# EAGLE schematic LoRaWio (EAGLE 6.3)
CNAME: GCLora Wio; COMPANY: Secluded.io; CREVISION: 1; DESIGNER: SkipXtian
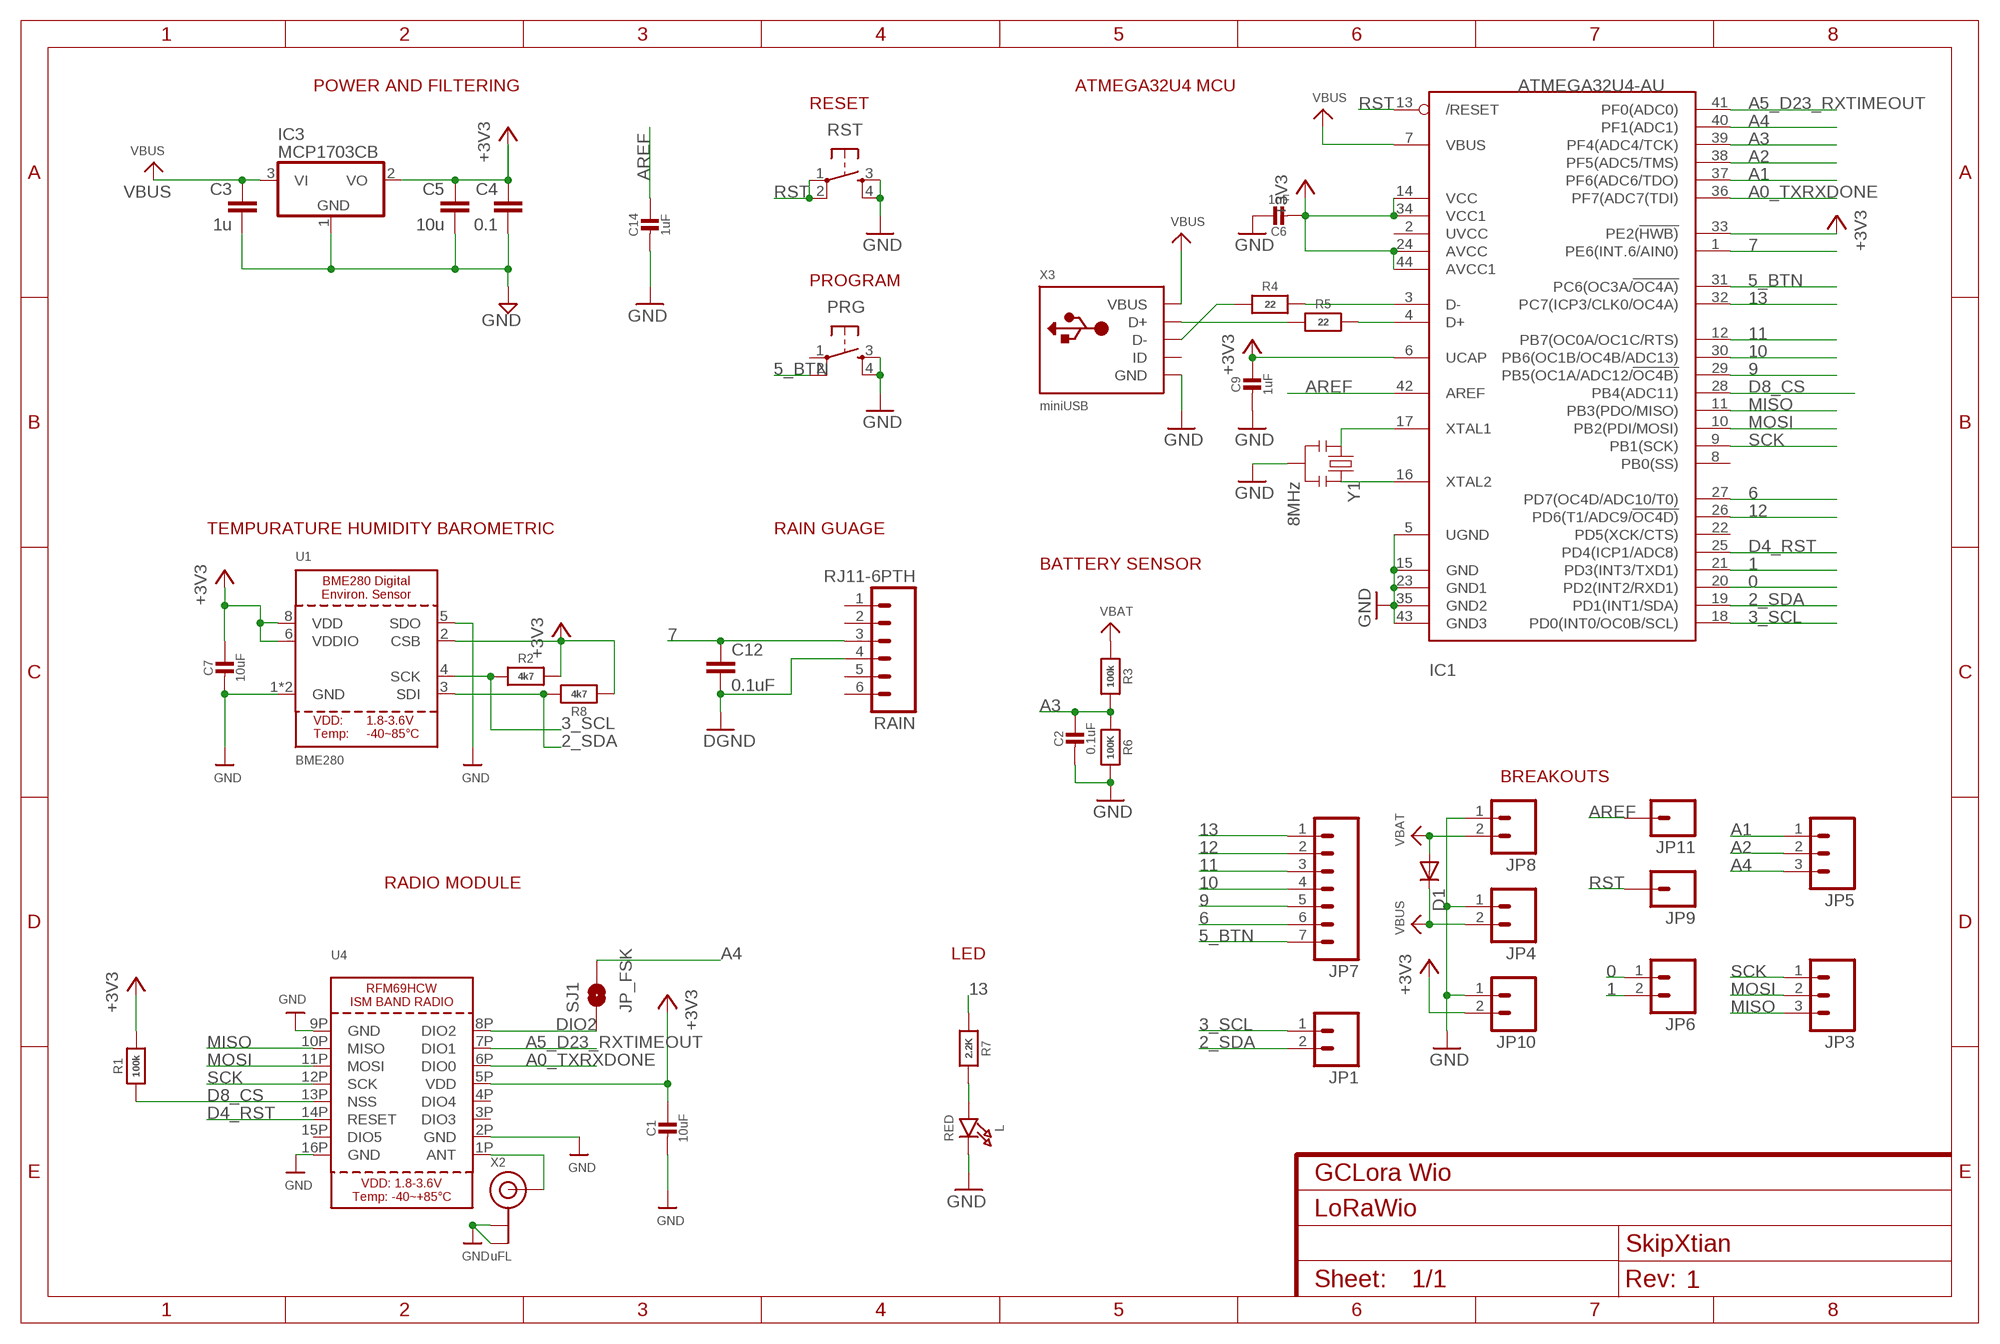
[diagram p0: schematic, sheet 1]

## Parts
C1  10uF  CAP_CERAMIC0805-NOOUTLINE  [0805-NO]
C2  0.1uF  CAP_CERAMIC0805-NOOUTLINE  [0805-NO]
C3  1u  CAP0805  [0805]
C4  0.1  CAP0805  [0805]
C5  10u  CAP0805-CAP  [0805-CAP]
C6  1uF  CAP_CERAMIC0805-NOOUTLINE  [0805-NO]
C7  10uF  CAP_CERAMIC0805-NOOUTLINE  [0805-NO]
C9  1uF  CAP_CERAMIC0805-NOOUTLINE  [0805-NO]
C12  0.1uF  CAP0805  [0805]
C14  1uF  CAP_CERAMIC0805-NOOUTLINE  [0805-NO]
D1  DIODESOD  [SOD-323]
IC1  ATMEGA32U4-AU  [TQFP44]
IC3  MCP1703CB  [SOT23]
JP1  M021X02_NO_SILK  [1X02_NO_SILK]
JP3  M031X03_NO_SILK  [1X03_NO_SILK]
JP4  M021X02_NO_SILK  [1X02_NO_SILK]
JP5  M031X03_NO_SILK  [1X03_NO_SILK]
JP6  M021X02_NO_SILK  [1X02_NO_SILK]
JP7  M07  [1X07]
JP8  M021X02_NO_SILK  [1X02_NO_SILK]
JP9  M01PTH_NO_SILK_YES_STOP  [1X01_NO_SILK]
JP10  M021X02_NO_SILK  [1X02_NO_SILK]
JP11  M01PTH_NO_SILK_YES_STOP  [1X01_NO_SILK]
L  RED  LED0805_NOOUTLINE  [CHIPLED_0805_NOOUTLINE]
PRG  TAC_SWITCHSMD  [TACTILE_SWITCH_SMD]
R1  100k  RESISTOR0805_NOOUTLINE  [0805-NO@1]
R2  4k7  RESISTOR0805_NOOUTLINE  [0805-NO@1]
R3  100k  RESISTOR0805_NOOUTLINE  [0805-NO@1]
R4  22  RESISTOR0805_NOOUTLINE  [0805-NO@1]
R5  22  RESISTOR0805_NOOUTLINE  [0805-NO@1]
R6  100K  RESISTOR0805_NOOUTLINE  [0805-NO@1]
R7  2.2K  RESISTOR0805_NOOUTLINE  [0805-NO@1]
R8  4k7  RESISTOR0805_NOOUTLINE  [0805-NO@1]
RAIN  RJ11-6PTH  [RJ11-6]
RST  TAC_SWITCHSMD  [TACTILE_SWITCH_SMD]
SJ1  JP_FSK  SPARKFUN-PASSIVES_SOLDERJUMPERNO  [SPARKFUN-PASSIVES_SJ_2S-NO]
U1  BME280  [BME280]
U4  RFM69HCW_SMT  [RFMHCW_SMT]
X2  uFL  ANTENNA_U.FL  [U.FL]
X3  miniUSB  USBMINIBLARGE  [USB-MINIB_LARGER]
Y1  8MHz  RESONATORSMD  [RESONATOR-SMD]

## Nets
0: IC1.20(PD2(INT2/RXD1)) JP6.1
1: IC1.21(PD3(INT3/TXD1)) JP6.2
2_SDA: IC1.19(PD1(INT1/SDA)) JP1.2 R8.2 U1.3(SDI)
3_SCL: IC1.18(PD0(INT0/OC0B/SCL)) JP1.1 R2.1 U1.4(SCK)
5_BTN: IC1.31(PC6(OC3A/!OC4A)) JP7.7 PRG.2
6: IC1.27(PD7(OC4D/ADC10/T0)) JP7.6
7: C12.1 IC1.1(PE6(INT.6/AIN0)) RAIN.3
9: IC1.29(PB5(OC1A/ADC12/!OC4B)) JP7.5
10: IC1.30(PB6(OC1B/OC4B/ADC13)) JP7.4
11: IC1.12(PB7(OC0A/OC1C/RTS)) JP7.3
12: IC1.26(PD6(T1/ADC9/!OC4D)) JP7.2
13: IC1.32(PC7(ICP3/CLK0/OC4A)) JP7.1 R7.1
+3V3: C1.1 C4.1 C5.1 C6.2 C7.1 C9.1 IC1.6(UCAP) IC1.14(VCC) IC1.24(AVCC) IC1.33(PE2(!HWB)) IC1.34(VCC1) IC1.44(AVCC1) IC3.2(VO) JP10.2 R1.2 R2.2 R8.1 U1.2(CSB) U1.6(VDDIO) U1.8(VDD) U4.5P(VDD)
A0_TXRXDONE: IC1.36(PF7(ADC7(TDI)) U4.6P(DIO0)
A1: IC1.37(PF6(ADC6/TDO)) JP5.1
A2: IC1.38(PF5(ADC5/TMS)) JP5.2
A3: C2.1 IC1.39(PF4(ADC4/TCK)) R3.2 R6.1
A4: IC1.40(PF1(ADC1)) JP5.3 SJ1.2
A5_D23_RXTIMEOUT: IC1.41(PF0(ADC0)) U4.7P(DIO1)
ANT: U4.1P(ANT) X2.3(SIGNAL)
AREF: C14.1 IC1.42(AREF) JP11.1
D4_RST: IC1.25(PD4(ICP1/ADC8)) U4.14P(RESET)
D8_CS: IC1.28(PB4(ADC11)) R1.1 U4.13P(NSS)
D+: IC1.4(D+) R5.2
D-: IC1.3(D-) R4.2
DIO2: SJ1.1 U4.8P(DIO2)
GND: C1.2 C2.2 C3.2 C4.2 C5.2 C6.1 C7.2 C9.2 C12.2 C14.2 IC1.5(UGND) IC1.15(GND) IC1.23(GND1) IC1.35(GND2) IC1.43(GND3) IC3.1(GND) JP4.1 JP8.1 JP10.1 L.C PRG.3 PRG.4 R6.2 RAIN.4 RST.3 RST.4 U1.1(GND) U1.5(SDO) U1.7(GND) U4.2P(GND) U4.9P(GND) U4.16P(GND) X2.1(GND) X2.2(GND) X3.GND X3.GND1(GND) X3.GND2(GND) X3.GND3(GND) X3.GND4(GND) Y1.2 ; supply symbol labelled DGND
MISO: IC1.11(PB3(PDO/MISO)) JP3.3 U4.10P(MISO)
MOSI: IC1.10(PB2(PDI/MOSI)) JP3.2 U4.11P(MOSI)
N$2: L.A R7.2
N$11: IC1.16(XTAL2) Y1.3
N$12: IC1.17(XTAL1) Y1.1
N$15: R5.1 X3.D+
N$16: R4.1 X3.D-
RST: IC1.13(/RESET) JP9.1 RST.1 RST.2
SCK: IC1.9(PB1(SCK)) JP3.1 U4.12P(SCK)
VBAT: D1.2(A) JP8.2 R3.1
VBUS: C3.1 D1.1(C) IC1.7(VBUS) IC3.3(VI) JP4.2 X3.VBUS
Unconnected: IC1.2(UVCC) IC1.8(PB0(SS)) IC1.22(PD5(XCK/CTS)) PRG.1 RAIN.1 RAIN.2 RAIN.5 RAIN.6 U4.3P(DIO3) U4.4P(DIO4) U4.15P(DIO5) X3.ID

## Notes on the sheet
- POWER AND FILTERING | ATMEGA32U4 MCU
- RESET
- PROGRAM
- TEMPURATURE HUMIDITY BAROMETRIC | RAIN GUAGE
- BATTERY SENSOR
- BREAKOUTS
- RADIO MODULE
- LED

## Library data of the parts
C1 C2 C6 C7 C9 C14 = microbuilder:CAP_CERAMIC: Ceramic Capacitors For new designs, use the packages preceded by an '_' character since they are more reliable: The following footprints should be used on most boards: _0402 - Standard footprint for regular board layouts _0603 - Standard footprint for regular board layouts _0805 - Standard footprint for regular board layouts _1206 - Standard footprint for regular board layouts For extremely tight-pitch boards where space is at a premium, the following 'micro-pitch' footprints can be used (smaller pads, no silkscreen outline, etc.): _0402MP - Micro-pitch footprint for very dense/compact boards _0603MP - Micro-pitch footprint for very dense/compact boards _0805MP - Micro-pitch footprint for very dense/compact boards _1206MP - Micro-pitch footprint for very dense/compact boards
C3-C5 = LowPowerLab:CAP: Capacitor Standard 0603 ceramic capacitor, and 0.1" leaded capacitor.
C12 = SparkFun-Capacitors:CAP: Capacitor Standard 0603 ceramic capacitor, and 0.1" leaded capacitor.
D1 = SparkFun-DiscreteSemi:DIODE: Diode These are standard reverse protection diodes and small signal diodes. SMA package can handle up to about 1A. SOD-323 can handle about 200mA. What the SOD-323 package when ordering, there are some mfgs out there that are 5-pin packages.
IC1 = microbuilder:ATMEGA32U4: http://www.ladyada.net/library/eagle
IC3 = linear:MCP1703: 250 mA, 16V, Low Quiescent Current LDO Regulator Source: http://ww1.microchip.com/downloads/en/DeviceDoc/22049b.pdf
JP1 JP4 JP6 JP8 JP10 = SparkFun-Connectors:M02: Standard 2-pin 0.1" header. Use with - straight break away headers ( PRT-00116) - right angle break away headers (PRT-00553) - swiss pins (PRT-00743) - machine pins (PRT-00117) - female headers (PRT-00115) Molex polarized connector foot print use with: PRT-08233 with associated crimp pins and housings. 2.54_SCREWTERM for use with PRT-10571. 3.5mm Screw Terminal footprints for PRT-08084 5mm Screw Terminal footprints for use with PRT-08432
JP3 JP5 = SparkFun-Connectors:M03: Header 3 Standard 3-pin 0.1" header. Use with straight break away headers (SKU : PRT-00116), right angle break away headers (PRT-00553), swiss pins (PRT-00743), machine pins (PRT-00117), and female headers (PRT-00115). Molex polarized connector foot print use with SKU : PRT-08232 with associated crimp pins and housings.
JP7 = SparkFun-Connectors:M07: Header 7 Standard 7-pin 0.1" header. Use with straight break away headers (SKU : PRT-00116), right angle break away headers (PRT-00553), swiss pins (PRT-00743), machine pins (PRT-00117), and female headers (PRT-00115). NOTES ON THE VARIANTS LOCK and LOCK_LONGPADS... This footprint was designed to help hold the alignment of a through-hole component (i.e. 7-pin header) while soldering it into place. You may notice that each hole has been shifted either up or down by 0.005 of an inch from it's more standard position (which is usually a perfectly straight line). This slight alteration caused the pins (the squares in the middle) to touch the edges of the holes. Because they are alternating, it causes a "brace" to hold the header in place. 0.005 has proven to be the perfect amount of "off-center" position when using our standard breakaway headers. Although looks a little odd when you look at the bare footprint, once you have a header in there, the alteration is very hard to notice. Also, if you push a header all the way into place, it is covered up entirely on the bottom side. This idea of altering the position of holes to aid alignment will be further integrated into the Sparkfun Library for other footprints. It can help hold any component with 3 or more connection pins.
JP9 JP11 = SparkFun-Connectors:M01: Header 1 Standard 1-pin 0.1" header. Use with straight break away headers (SKU : PRT-00116), right angle break away headers (PRT-00553), swiss pins (PRT-00743), machine pins (PRT-00117), and female headers (PRT-00115).
L = microbuilder:LED: LED 0603 - 0603 Surface Mount Package 2mA: Green LED - Low Power (3.9mcd, 2ma, 1.7Vf) - Digikey: 475-2709-2-ND Orange LED - Low Power (9.8mcd, 2ma, 1.8Vf) - Digikey: 475-1194-2-ND Red LED - Low Power (5mcd, 2ma, 1.8Vf) - Digikey: 475-1195-2-ND Yellow LED - Low Power (7mcd, 2ma, 1.8Vf) - Digikey: 475-1196-2-ND 5mA: Blue LED - Low Power (17mcd, 5ma, 2.9Vf) - Digikey: LNJ937W8CRACT-ND 0805 - 0805 Surface Mount Package 2mA: Red LED (8.8mcd, 2mA, 1.8Vf, Clear) - Low Power [Digikey: 475-2510-1-ND] Green LED (5mcd, 2mA, 1.8Vf, Clear) - Low Power [Digikey: 475-2730-1-ND] Yellow LED (11.3mcd, 2mA, 1.8Vf, Clear) - Low Power [Digikey: 475-2555-1-ND] 20mA: Red LED (104mcd, 20mA, Diffused) - LS R976 [Digikey: 475-1278-6-ND] Red LED (12mcd, 20mA, 2.0Vf, Clear) - APT2012EC [Digikey: 754-1128-1-ND] Green LED (15mcd, 20mA, 2.2Vf, Clear) - APT2012GC [Digikey: 754-1131-1-ND] Orange LED (160mcd, 20mA, 2.1Vf, Clear) - APT2012SECK [Digikey: 754-1130-1-ND] 1206 - 1206 Surface Mount Package Green LED (26mcd, 20mA, Diffused) - LG N971 [Digikey: 475-1407-6-ND] Red LED (15mcd, 20mA, Diffused) - LH N974 [Digikey: 475-1416-6-ND] Cree - Cree High-Power Surface Mount LEDs XPEBWT-L1-0000-00D50 - White 111lm 350mA 2.9Vf 6200K 110° XTEAWT-00-0000-00000LEE3 - White 114lm 350mA 2.85Vf 5000K 115° Everlight - Everlight 45-21 Series Surface Mount LEDs 45-21/QK2C-B2832AC2CB2/2T - Warm White 2000mcd 20mA 3.25Vf 3050K 120° 45-21/LK2C-B38452C4CB2/2T - Nuetral White 2000mcd 20mA 3.25Vf 4150K 120° 45-21/LK2C-B50634C6CB2/2T - Cold White 2200mcd 20mA 3.25Vf 5650K 120° PLCC2 Reverse Mount LS T77K-J1L2-1-0-2-R18-Z - Red 11.25mcd 2mA 1.8Vf 630nm 120° LO T77K-L1M2-24-Z - Orange 19.6mcd 2mA 1.8Vf 606nm 120° LY T77K-K2M1-26-Z - Yellow 15.7mcd 2mA 1.8Vf 587nm 120°
PRG RST = SparkFun-Electromechanical:TAC_SWITCH: Momentary Switch Button commonly used for reset or general input. Spark Fun Electronics SKU : COM-00097 SMT- SWCH-08247; PROD_ID: SWCH-08247
R1-R8 = microbuilder:RESISTOR: Resistors For new designs, use the packages preceded by an '_' character since they are more reliable: The following footprints should be used on most boards: _0402 - Standard footprint for regular board layouts _0603 - Standard footprint for regular board layouts _0805 - Standard footprint for regular board layouts _1206 - Standard footprint for regular board layouts For extremely tight-pitch boards where space is at a premium, the following 'micro-pitch' footprints can be used (smaller pads, no silkscreen outline, etc.): _0402MP - Micro-pitch footprint for very dense/compact boards _0603MP - Micro-pitch footprint for very dense/compact boards _0805MP - Micro-pitch footprint for very dense/compact boards _1206MP - Micro-pitch footprint for very dense/compact boards
RAIN = SparkFun-Connectors:RJ11-6: RJ11 Jack Simple 6 pin RJ11 jack. Commonly found on CAT3 devices and Microchip programmers. SKU: PRT-00132; PROD_ID: CONN-08590; VALUE: RJ11
SJ1 = tempLED_GARAGE_BOX:SPARKFUN-PASSIVES_SOLDERJUMPER: Solder Jumper Standard SMD solder jumper. Used to automate production. Two varients : Normally Open and Normally Closed are the same, but have different paste layers. NC will have a large amount of paste and should jumper during reflow.
U1 = microbuilder:BME280: BME280 - Environmental Sensor (I2C + SPI)
U4 = microbuilder:RFM69HCW: RFM69HCW - ISM Band RF Transceiver
X2 = microbuilder:ANTENNA_U.FL: U.FL Antenna Connector
X3 = microbuilder:USB: USB Connectors USBMINIB - Surface Mount Female Mini-B USB Connector 4UConnector: 06564
Y1 = SparkFun:RESONATOR: Resonator Small SMD resonator. This is the itty bitty 10/20MHz resonators with built in caps. CSTCE10M0G55 and CSTCE20M0V53. Footprint has been reviewed closely but hasn't been tested yet.

## Net classes
1 power: width 0.381 mm, clearance 0.254 mm